# EasyEDA Pro project EDev.epro

# Schematic Schematic1
Board Name: Board1; Create Date: 2025-07-24; Page Name: P1; Project Name: ODO2; Schematic Name: Schematic1; Update Date: 2025-07-24; Company: EasyEDA.com; Page Size: A4; Version: V1.0
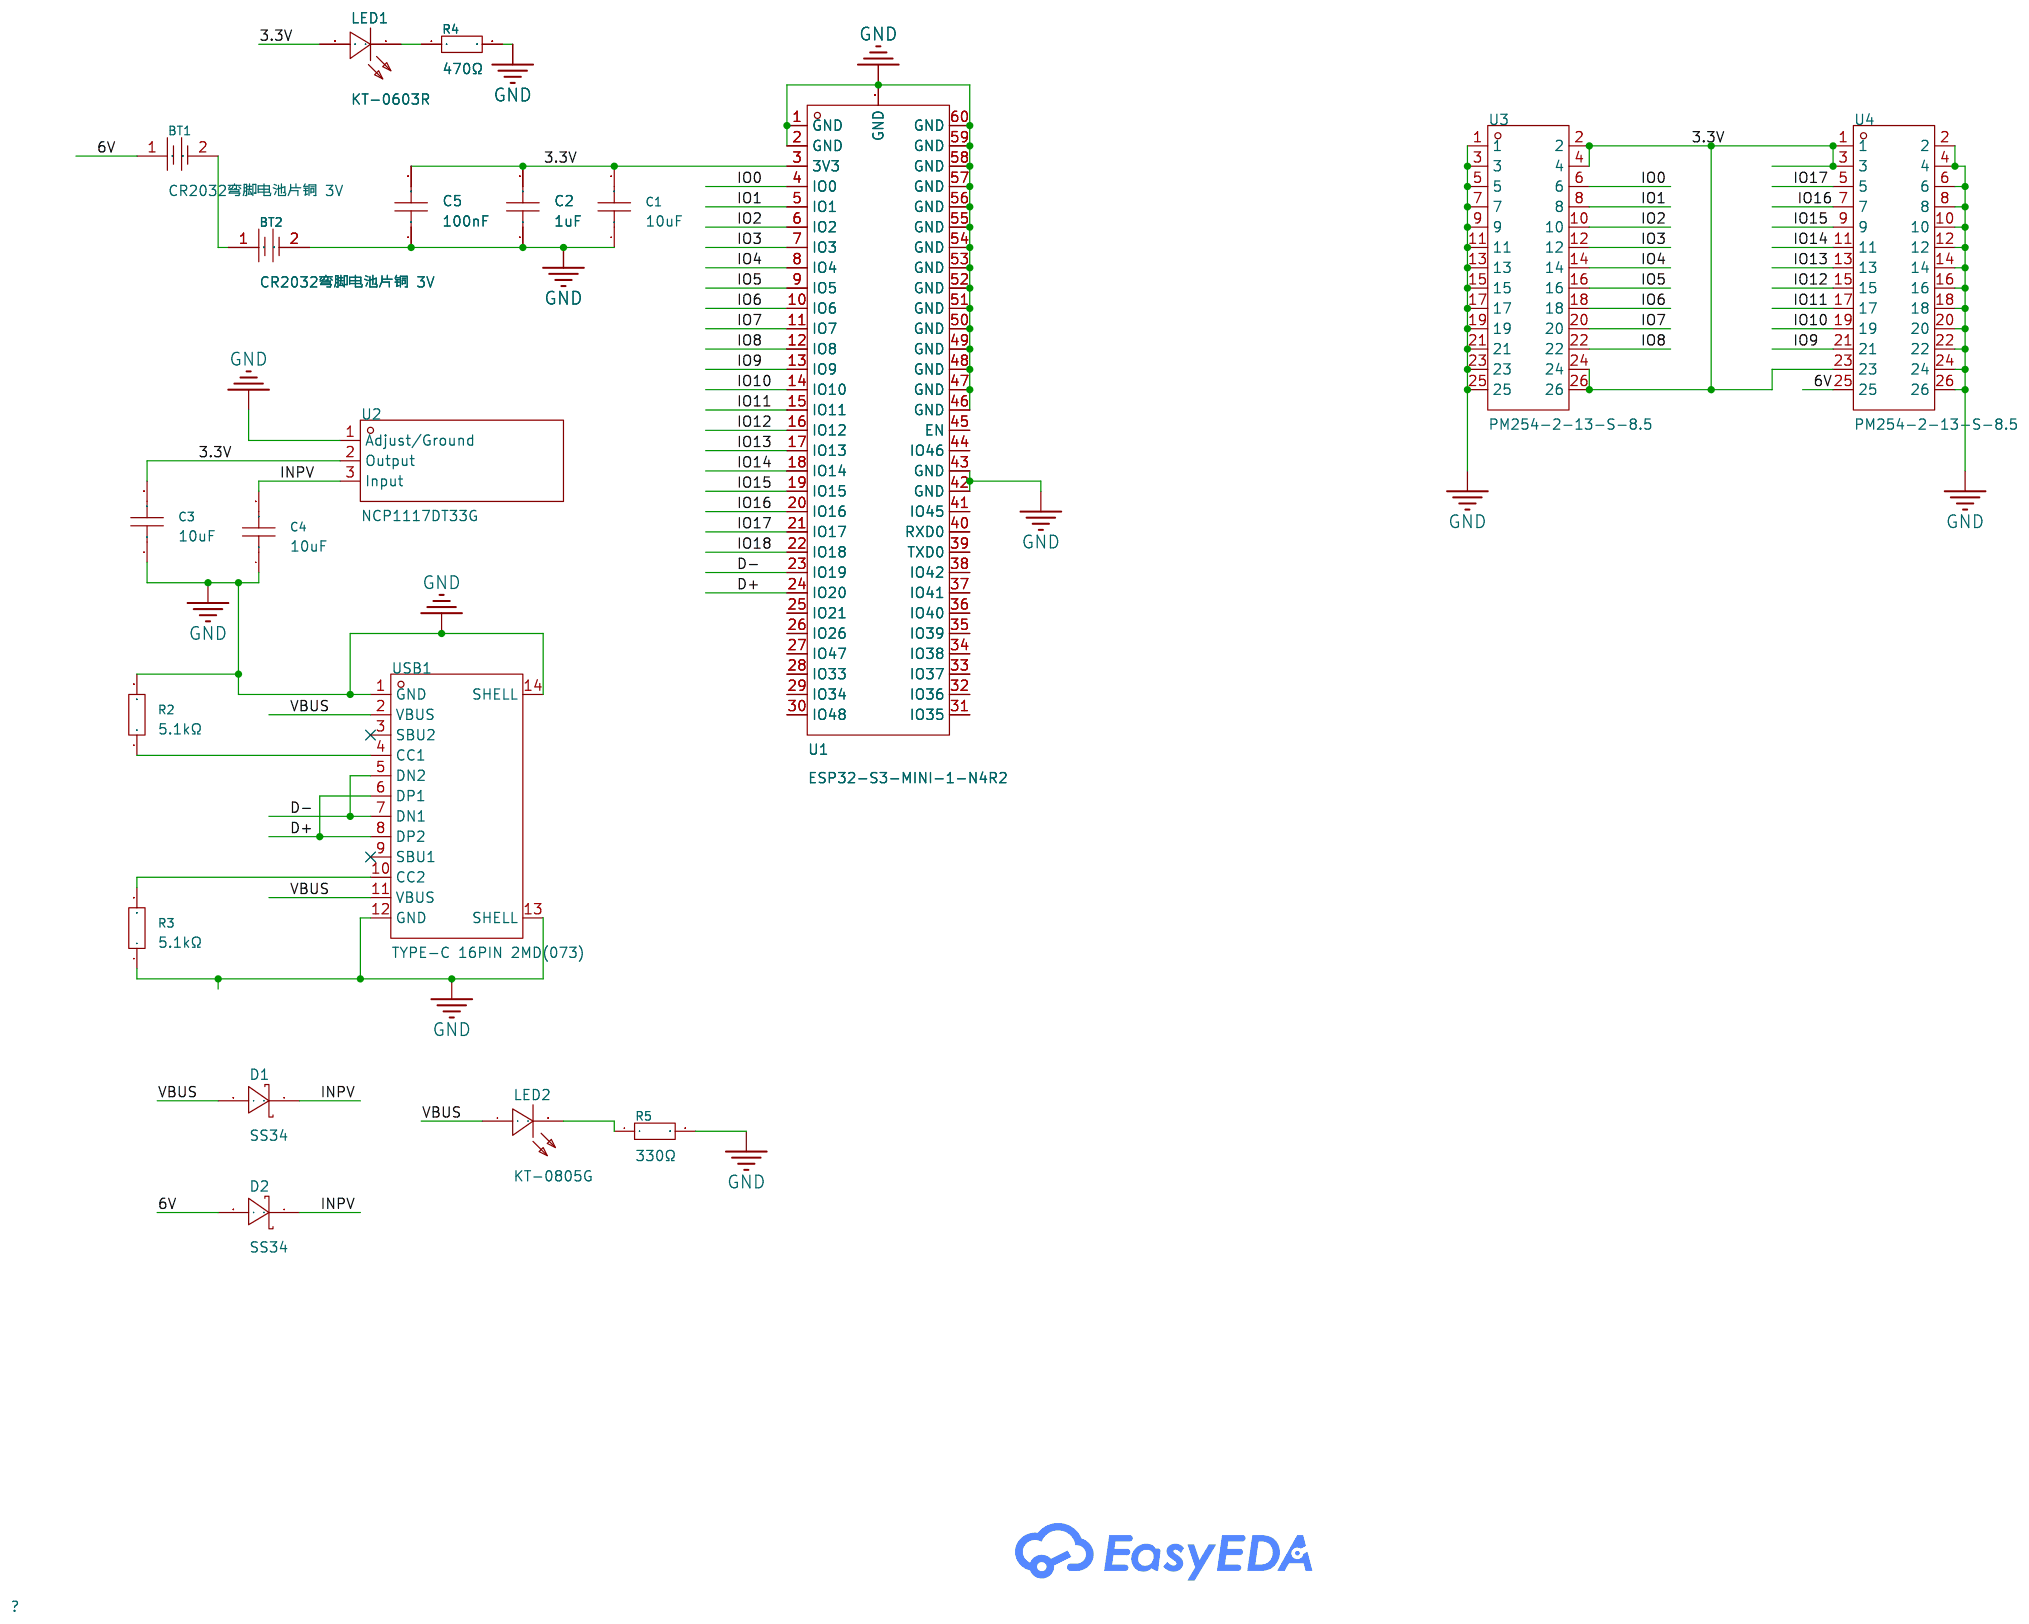
[diagram p0: schematic sheet]

## Parts
BT1  CR2032弯脚电池片铜 3V  [BAT-SMD_CR2032-3V]
BT2  CR2032弯脚电池片铜 3V  [BAT-SMD_CR2032-3V]
C1  10uF  [C0603]
C2  1uF  [C0603]
C3  10uF  [C0603]
C4  10uF  [C0603]
C5  100nF  [C0402]
D1  SS34  [SMA_L4.3-W2.6-LS5.2-RD]
D2  SS34  [SMA_L4.3-W2.6-LS5.2-RD]
LED1  KT-0603R  [LED0603-RD]
LED2  KT-0805G  [LED0805-R-RD]
R2  5.1kΩ  [R0402]
R3  5.1kΩ  [R0402]
R4  470Ω  [R0805]
R5  330Ω  [R0805]
U1  ESP32-S3-MINI-1-N4R2  [BULETM-SMD_ESP32-S3-MINI-1-N8]
U2  NCP1117DT33G  [TO-252_L6.5-W6.1-P4.58-LS9.9-BR]
U3  PM254-2-13-S-8.5  [HDR-SMD_26P-P2.54-V-F-R2-C13-LS7.2]
U4  PM254-2-13-S-8.5  [HDR-SMD_26P-P2.54-V-F-R2-C13-LS7.2]
USB1  TYPE-C 16PIN 2MD(073)  [USB-C-SMD_TYPE-C-6PIN-2MD-073]

## Library data of the parts
BT1 BT2 = CR2032弯脚电池片铜 3V: Connector Type:Battery button Battery Type:CR2032 Operating Temperature Range:- Operating Temperature Range:-; Supplier Part: C70373; Manufacturer: Q&J; Supplier Footprint: SMD; JLCPCB Part Class: Extended Part; Datasheet: https://atta.szlcsc.com/upload/public/pdf/source/20160427/1461725216470.pdf; Supplier: LCSC; Connector Type: Battery button; Battery Type: CR2032
C1 C3 C4 = CL10A106MA8NRNC: Capacitance: Tolerance:±20% Tolerance:±20% Voltage Rated: Temperature Coefficient:; LCSC Part Name: 10uF ±20% 25V; Supplier Part: C96446; Manufacturer: SAMSUNG(三星); Supplier Footprint: 0603; JLCPCB Part Class: Basic Part; Datasheet: https://atta.szlcsc.com/upload/public/pdf/source/20160218/1457707763339.pdf; Supplier: LCSC; Tolerance: ±20%
C2 = CL10A105KB8NNNC: Capacitance: Tolerance:±10% Tolerance:±10% Voltage Rated: Temperature Coefficient:; LCSC Part Name: 1uF ±10% 50V; Supplier Part: C15849; Manufacturer: SAMSUNG(三星); Supplier Footprint: 0603; JLCPCB Part Class: Basic Part; Datasheet: https://atta.szlcsc.com/upload/public/pdf/source/20160218/1457707763339.pdf; Supplier: LCSC; Tolerance: ±10%
C5 = CL05B104KO5NNNC: Capacitance: Tolerance:±10% Tolerance:±10% Voltage Rated: Temperature Coefficient:; LCSC Part Name: 100nF ±10% 16V; Supplier Part: C1525; Manufacturer: SAMSUNG(三星); Supplier Footprint: 0402; JLCPCB Part Class: Basic Part; Datasheet: https://atta.szlcsc.com/upload/public/pdf/source/20160218/1457707763339.pdf; Supplier: LCSC; Tolerance: ±10%
D1 D2 = SS34_C8678: Diode Configuration:Independent Type Forward Voltage (Vf@If):550mV@3A Reverse Voltage (Vr):40V Rectified Current:3A Reverse Leakage Current (Ir):500uA@40V; LCSC Part Name: 电压:40V 电流:3A; Supplier Part: C8678; Manufacturer: MDD(辰达半导体); Supplier Footprint: SMA(DO-214AC); JLCPCB Part Class: Basic Part; Datasheet: https://atta.szlcsc.com/upload/public/pdf/source/20240710/2118BB86FDDB2E0B294389AC1F3F65C8.pdf; Supplier: LCSC; Diode Configuration: Independent Type; Forward Voltage (Vf@If): 550mV@3A; Reverse Voltage (Vr): 40V; Rectified Current: 3A; Reverse Leakage Current (Ir): 500uA@40V
LED1 = KT-0603R: Emitted Color:Red Power Dissipation:- Forward Current:- Dominant Wavelength:- Dominant Wavelength:- Peak Wavelength:- Diode Configuration:- Lens Color:- Color Temperature:- Color Temperature:- Viewing Angle:- Mounting Sytle:- Operating Temperature:-40℃~+8; LCSC Part Name: 0603 红灯 高亮; Supplier Part: C2286; Manufacturer: KENTO; Supplier Footprint: 0603; JLCPCB Part Class: Basic Part; Datasheet: https://atta.szlcsc.com/upload/public/pdf/source/20160616/1466072038404.pdf; Supplier: LCSC; Emitted Color: Red; Operating Temperature: -40℃~+85℃
LED2 = KT-0805G: Lamp Holder Type:- Emitted Color:Emerald Forward Voltage (VF):- Forward Voltage (VF):- Power Dissipation:- Forward Current:- Dominant Wavelength:- Dominant Wavelength:- Peak Wavelength:- Diode Configuration:- Lens Color:- Color Temperature:- Color Tempera; LCSC Part Name: 0805 翠绿 高亮; Supplier Part: C2297; Manufacturer: KENTO; Supplier Footprint: 0805; JLCPCB Part Class: Basic Part; Datasheet: https://atta.szlcsc.com/upload/public/pdf/source/20170209/1486607340485.pdf; Supplier: LCSC; Emitted Color: Emerald
R2 R3 = 0402WGF5101TCE: Type:Thick Film Resistors Resistance:5.1kΩ Tolerance:±1% Tolerance:±1% Power(Watts): Overload Voltage (Max): Temperature Coefficient:±100ppm/℃ Temperature Coefficient:±100ppm/℃ Operating Temperature Range:-55℃~+155℃ Operating Temperature Range:-55℃~+155℃; LCSC Part Name: 5.1kΩ ±1% 62.5mW 厚膜电阻; Supplier Part: C25905; Manufacturer: UNI-ROYAL(厚声); Supplier Footprint: 0402; JLCPCB Part Class: Basic Part; Datasheet: https://atta.szlcsc.com/upload/public/pdf/source/20200306/C422600_1E6D84923E4A46A82E41ADD87F860B5C.pdf; Supplier: LCSC; Type: Thick Film Resistors; Tolerance: ±1%; Temperature Coefficient: ±100ppm/℃; Operating Temperature Range: -55℃~+155℃
R4 = 0805W8F4700T5E: Type:Thick Film Resistors Resistance: Tolerance:±1% Tolerance:±1% Power(Watts): Overload Voltage (Max): Temperature Coefficient:±100ppm/℃ Temperature Coefficient:±100ppm/℃ Operating Temperature Range:-55℃~+155℃ Operating Temperature Range:-55℃~+155℃; LCSC Part Name: 470Ω ±1% 125mW 厚膜电阻; Supplier Part: C17710; Manufacturer: UNI-ROYAL(厚声); Supplier Footprint: 0805; JLCPCB Part Class: Basic Part; Datasheet: https://atta.szlcsc.com/upload/public/pdf/source/20200306/C422600_1E6D84923E4A46A82E41ADD87F860B5C.pdf; Supplier: LCSC; Type: Thick Film Resistors; Tolerance: ±1%; Temperature Coefficient: ±100ppm/℃; Operating Temperature Range: -55℃~+155℃
R5 = 0805W8F3300T5E: Type:Thick Film Resistors Resistance: Tolerance:±1% Tolerance:±1% Power(Watts): Overload Voltage (Max): Temperature Coefficient:±100ppm/℃ Temperature Coefficient:±100ppm/℃ Operating Temperature Range:-55℃~+155℃ Operating Temperature Range:-55℃~+155℃; LCSC Part Name: 330Ω ±1% 125mW 厚膜电阻; Supplier Part: C17630; Manufacturer: UNI-ROYAL(厚声); Supplier Footprint: 0805; JLCPCB Part Class: Basic Part; Datasheet: https://atta.szlcsc.com/upload/public/pdf/source/20200306/C422600_1E6D84923E4A46A82E41ADD87F860B5C.pdf; Supplier: LCSC; Type: Thick Film Resistors; Tolerance: ±1%; Temperature Coefficient: ±100ppm/℃; Operating Temperature Range: -55℃~+155℃
U1 = ESP32-S3-MINI-1-N4R2: Antenna Type:On-Board PCB Antenna; Supplier Part: C3013941; Manufacturer: ESPRESSIF(乐鑫); Supplier Footprint: SMD; JLCPCB Part Class: Extended Part; Supplier: LCSC; Antenna Type: On-Board PCB Antenna
U2 = NCP1117DT33G: Output Type:Fixed Maximum Input Voltage:20V Output Voltage:3.3V Output Voltage:3.3V Output Current:1A Power Supply Rejection Ratio (PSRR):64dB@(120Hz) Dropout Voltage:1.2V@(800mA) standby current:10mA Feature:ESD Protection；Thermal Protection(TSD)；Overcur; LCSC Part Name: NCP1117DT33G 停产; Supplier Part: C154606; Manufacturer: onsemi(安森美); Supplier Footprint: TO-252; JLCPCB Part Class: Extended Part; Datasheet: https://atta.szlcsc.com/upload/public/pdf/source/20220427/B2E229834B7C3B3BD212A269AE861712.pdf; Supplier: LCSC; Output Type: Fixed; Maximum Input Voltage: 20V; Output Voltage: 3.3V; Output Current: 1A; Power Supply Rejection Ratio (PSRR): 64dB@(120Hz); Dropout Voltage: 1.2V@(800mA); standby current: 10mA; Feature: ESD Protection；Thermal Protection(TSD)；Overcurrent Protection(OCP); Operating Temperature: 0℃~+125℃; Output Polarity: Positive electrode; Number of Outputs: 1
U3 U4 = PM254-2-13-S-8.5: Holes Structure:2x13P Pitch:2.54mm Row Spacing:2.54mm Circular Hole / Square Hole:方孔 Mounting Type:Brick nogging Number of Rows:双排 Number of Holes:26P Current Rating (Max):3A Holes Direction:Top Insulation Height:8.5mm Contact Material:Copper Alloy Operat; LCSC Part Name: 2x13P 间距:2.54mm 立贴; Supplier Part: C3975158; Manufacturer: HCTL(华灿天禄); Supplier Footprint: SMD,P=2.54mm; JLCPCB Part Class: Extended Part; Datasheet: https://atta.szlcsc.com/upload/public/pdf/source/20230609/7C6F8D8E301C6BBC8F19D55951C36597.pdf; Supplier: LCSC; Holes Structure: 2x13P; Pitch: 2.54mm; Row Spacing: 2.54mm; Circular Hole / Square Hole: 方孔; Mounting Type: Brick nogging; Number of Rows: 双排; Number of Holes: 26P; Current Rating (Max): 3A; Holes Direction: Top; Insulation Height: 8.5mm; Contact Material: Copper Alloy; Operating Temperature Range: -40℃~+105℃; Soldering Temperature(Max): 260℃@5S
USB1 = TYPE-C 16PIN 2MD(073): Connector Type:Type-C Protocol Standard:USB 3.1 Gender:Female Mounting Type:Surface Mount, Right Angle Number of Contacts:16P Number of Ports:1 Current Rating-Power:3A Voltage Rating:5V Connect-Disconnect Life:5,000 Cycles Supplementary Features:- Center; LCSC Part Name: Type-C 母 卧贴; Supplier Part: C2765186; Manufacturer: SHOU HAN(首韩); Supplier Footprint: SMD; JLCPCB Part Class: Extended Part; Datasheet: https://atta.szlcsc.com/upload/public/pdf/source/20250506/FFB74EDFDFA0AC372CE4A8E4F739CCEF.pdf; Supplier: LCSC; Connector Type: Type-C; Protocol Standard: USB 3.1; Gender: Female; Mounting Type: Surface Mount, Right Angle; Number of Contacts: 16P; Number of Ports: 1; Current Rating-Power: 3A; Voltage Rating: 5V; Connect-Disconnect Life: 5,000 Cycles; Detection color: Black; Operating Temperature: -25℃~+85℃

## Nets
3.3V: C1.2 C2.2 C3.2 C5.2 LED1.2(A) U1.3(3V3) U2.2(Output) U3.2 U3.4 U3.24 U3.26 U4.1 U4.3 U4.23
6V: BT1.1 D2.2(A) U4.25
GND: BT2.2 C1.1 C2.1 C3.1 C4.1 C5.1 R2.2 R3.1 R4.2 R5.2 U1.1(GND) U1.2(GND) U1.42(GND) U1.43(GND) U1.46(GND) U1.47(GND) U1.48(GND) U1.49(GND) U1.50(GND) U1.51(GND) U1.52(GND) U1.53(GND) U1.54(GND) U1.55(GND) U1.56(GND) U1.57(GND) U1.58(GND) U1.59(GND) U1.60(GND) U1.GND U2.1(Adjust/Ground) U3.1 U3.3 U3.5 U3.7 U3.9 U3.11 U3.13 U3.15 U3.17 U3.19 U3.21 U3.23 U3.25 U4.2 U4.4 U4.6 U4.8 U4.10 U4.12 U4.14 U4.16 U4.18 U4.20 U4.22 U4.24 U4.26 USB1.1(GND) USB1.12(GND) USB1.13(SHELL) USB1.14(SHELL)
VBUS: D1.2(A) LED2.1(A) USB1.2(VBUS) USB1.11(VBUS)
D+: U1.24(IO20) USB1.6(DP1) USB1.8(DP2)
D-: U1.23(IO19) USB1.5(DN2) USB1.7(DN1)
INPV: C4.2 D1.1(K) D2.1(K) U2.3(Input)
IO0: U1.4(IO0) U3.6
IO1: U1.5(IO1) U3.8
IO2: U1.6(IO2) U3.10
IO3: U1.7(IO3) U3.12
IO4: U1.8(IO4) U3.14
IO5: U1.9(IO5) U3.16
IO6: U1.10(IO6) U3.18
IO7: U1.11(IO7) U3.20
IO8: U1.12(IO8) U3.22
IO9: U1.13(IO9) U4.21
IO10: U1.14(IO10) U4.19
IO11: U1.15(IO11) U4.17
IO12: U1.16(IO12) U4.15
IO13: U1.17(IO13) U4.13
IO14: U1.18(IO14) U4.11
IO15: U1.19(IO15) U4.9
IO16: U1.20(IO16) U4.7
IO17: U1.21(IO17) U4.5
IO18: U1.22(IO18)
$1N1027: BT1.2 BT2.1
$1N1544: R3.2 USB1.10(CC2)
$1N1551: R2.1 USB1.4(CC1)
$1N3968: LED1.1(K) R4.1
$1N4174: LED2.2(K) R5.1

Not connected (* = marked no-connect by the designer): U1 25(IO21) 26(IO26) 27(IO47) 28(IO33) 29(IO34) 30(IO48) 31(IO35) 32(IO36) 33(IO37) 34(IO38) 35(IO39) 36(IO40) 37(IO41) 38(IO42) 39(TXD0) 40(RXD0) 41(IO45) 44(IO46) 45(EN); USB1 3(SBU2)* 9(SBU1)*

# Board PCB1
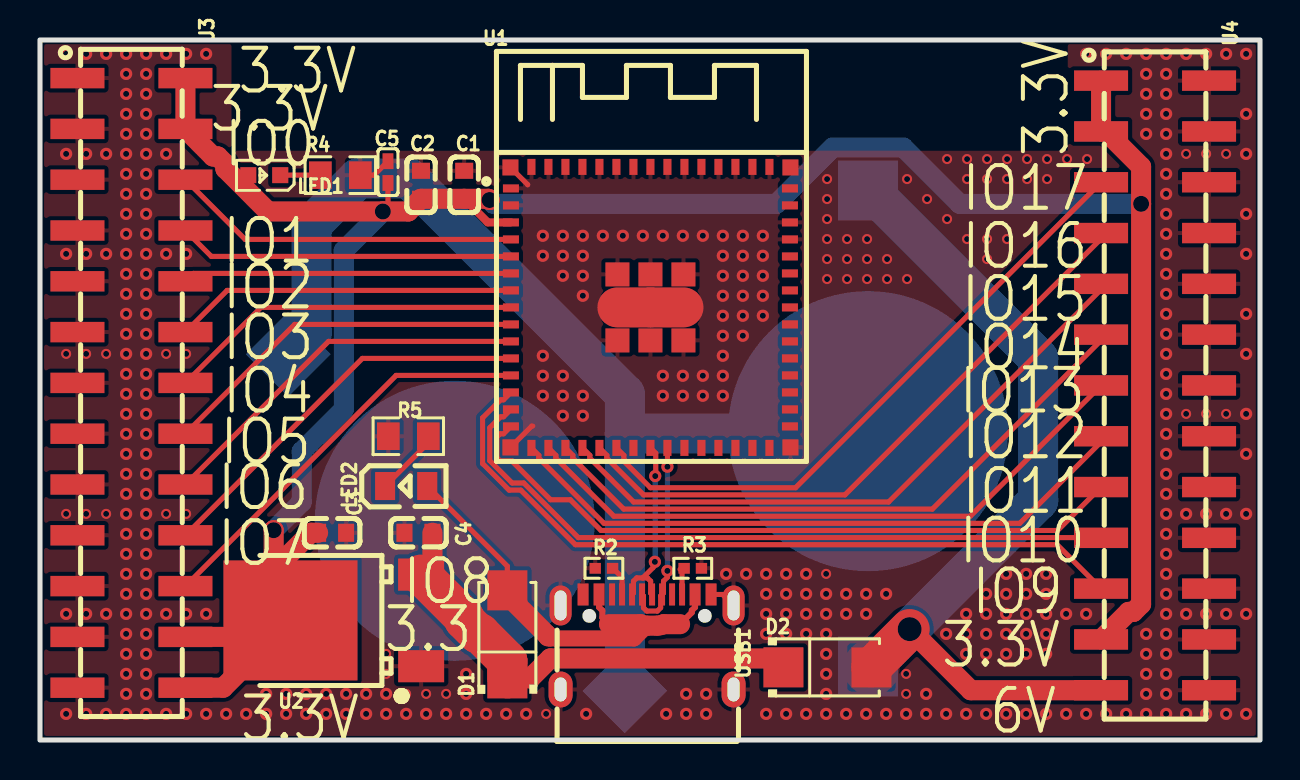
[diagram p1: board, top side]
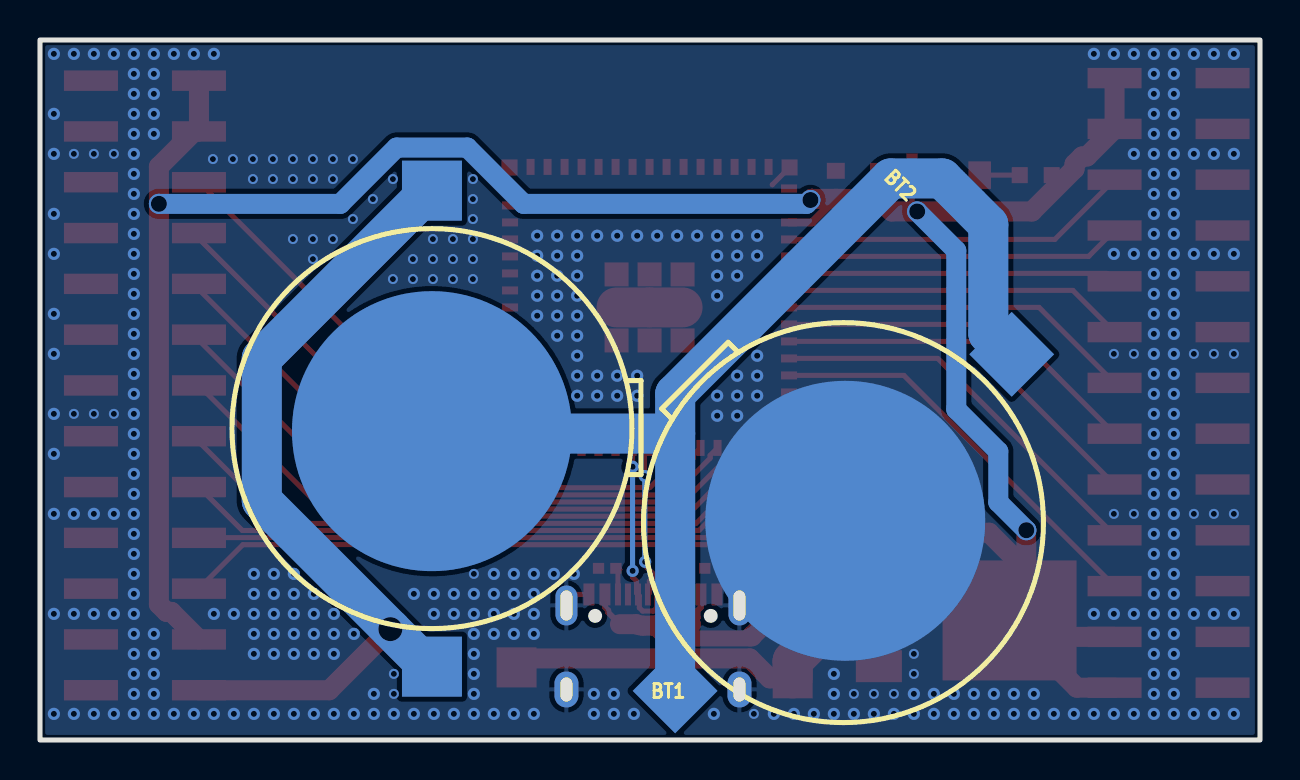
[diagram p2: board, bottom side, seen from below]

Outline 61 x 35 mm; copper layers: Top Layer, Bottom Layer. Coordinates in mm from the lower left corner of the outline.
Outline path: rectangle 0,35 61,0
Stack: Top Layer 0.035mm / Dielectric1 1.51mm FR4 er 4.5 / Bottom Layer 0.035mm

## Design rules (mm)
template: Custom Config
spacing copperThickness1oz (default): track to track 0.102, other pairs 0.152 to 0.3
spacing copperThickness2oz: track to track 0.203, other pairs 0.152 to 0.3
track width copperThickness1oz (default): min 0.127, default 0.254, max 2.54
track width copperThickness2oz: min 0.203, default 0.254, max 2.54
differential pair differentialPair (default): width min 0.127, default 0.254, max 2.54; gap min 0.152, default 0.152
via viaSize (default): diameter min 0.5, default 0.61, max 10; hole min 0.3, default 0.305, max 6.3
pour e593 uses copperRegion1

## Placement (name value [footprint] x y rotation side)
BT1  CR2032弯脚电池片铜 3V  [BAT-SMD_CR2032-3V]  41.4 15.57 0 bottom
BT2  CR2032弯脚电池片铜 3V  [BAT-SMD_CR2032-3V]  20.83 10.87 225 bottom
C1  10uF  [C0603]  21.21 27.76 270 top
C2  1uF  [C0603]  19.05 27.76 270 top
C3  10uF  [C0603]  14.6 10.36 180 top
C4  10uF  [C0603]  18.92 10.36 0 top
C5  100nF  [C0402]  17.4 28.4 270 top
D1  SS34  [SMA_L4.3-W2.6-LS5.2-RD]  23.37 5.28 90 top
D2  SS34  [SMA_L4.3-W2.6-LS5.2-RD]  39.37 3.63 0 top
LED1  KT-0603R  [LED0603-RD]  11.21 28.24 180 top
LED2  KT-0805G  [LED0805-R-RD]  18.31 12.7 0 top
R2  5.1kΩ  [R0402]  28.19 8.58 180 top
R3  5.1kΩ  [R0402]  32.64 8.58 180 top
R4  470Ω  [R0805]  15.02 28.24 0 top
R5  330Ω  [R0805]  18.41 15.19 180 top
U1  ESP32-S3-MINI-1-N4R2  [BULETM-SMD_ESP32-S3-MINI-1-N8]  30.52 21.63 0 top
U2  NCP1117DT33G  [TO-252_L6.5-W6.1-P4.58-LS9.9-BR]  15.79 5.98 0 top
U3  PM254-2-13-S-8.5  [HDR-SMD_26P-P2.54-V-F-R2-C13-LS7.2]  4.57 17.86 270 top
U4  PM254-2-13-S-8.5  [HDR-SMD_26P-P2.54-V-F-R2-C13-LS7.2]  55.75 17.73 270 top
USB1  TYPE-C 16PIN 2MD(073)  [USB-C-SMD_TYPE-C-6PIN-2MD-073]  30.35 4.9 0 top

## Footprints (pads in the part's own frame, mm; a bottom-side part is the same pattern mirrored in y, then rotated)
BAT-SMD_CR2032-3V
  rect 3x3 smd: 1(0,-11.9) 1(0,11.9)
  round 14 smd: 2(0,0.127)
BULETM-SMD_ESP32-S3-MINI-1-N8
  rect 0.8x0.4 smd: 1(-6.975,5.95) 2(-6.975,5.1) 3(-6.975,4.25) 4(-6.975,3.4) 5(-6.975,2.55) 6(-6.975,1.7) 7(-6.975,0.85) 8(-6.975,0) 9(-6.975,-0.85) 10(-6.975,-1.7) 11(-6.975,-2.55) 12(-6.975,-3.4) 13(-6.975,-4.25) 14(-6.975,-5.1) 15(-6.975,-5.95) 31(6.975,-5.95) 32(6.975,-5.1) 33(6.975,-4.25) 34(6.975,-3.4) 35(6.975,-2.55) 36(6.975,-1.7) 37(6.975,-0.85) 38(6.975,0) 39(6.975,0.85) 40(6.975,1.7) 41(6.975,2.55) 42(6.975,3.4) 43(6.975,4.25) 44(6.975,5.1) 45(6.975,5.95)
  rect 0.4x0.8 smd: 16(-5.95,-7.025) 17(-5.1,-7.025) 18(-4.25,-7.025) 19(-3.4,-7.025) 20(-2.55,-7.025) 21(-1.7,-7.025) 22(-0.85,-7.025) 23(0,-7.025) 24(0.85,-7.025) 25(1.7,-7.025) 26(2.55,-7.025) 27(3.4,-7.025) 28(4.25,-7.025) 29(5.1,-7.025) 30(5.95,-7.025) 46(5.95,7.025) 47(5.1,7.025) 48(4.25,7.025) 49(3.4,7.025) 50(2.55,7.025) 51(1.7,7.025) 52(0.85,7.025) 53(0,7.025) 54(-0.85,7.025) 55(-1.7,7.025) 56(-2.55,7.025) 57(-3.4,7.025) 58(-4.25,7.025) 59(-5.1,7.025) 60(-5.95,7.025)
  rect 0.8x0.8 smd: GND(-7,7) GND(-7,-7) GND(7,7) GND(7,-7)
  rect 1.2x1.2 smd: GND(-1.65,1.65) GND(-1.65,0) GND(-1.65,-1.65) GND(0,1.65) GND(0,0) GND(0,-1.65) GND(1.65,1.65) GND(1.65,0) GND(1.65,-1.65)
C0402
  rect 0.79x0.54 smd: 1(-0.545,0) 2(0.545,0)
C0603
  rect 0.8x0.9 smd: 1(-0.7,0) 2(0.7,0)
HDR-SMD_26P-P2.54-V-F-R2-C13-LS7.2
  rect 1.02x2.7 smd: 1(-15.24,-2.7) 2(-15.24,2.7) 3(-12.7,-2.7) 4(-12.7,2.7) 5(-10.16,-2.7) 6(-10.16,2.7) 7(-7.62,-2.7) 8(-7.62,2.7) 9(-5.08,-2.7) 10(-5.08,2.7) 11(-2.54,-2.7) 12(-2.54,2.7) 13(0,-2.7) 14(0,2.7) 15(2.54,-2.7) 16(2.54,2.7) 17(5.08,-2.7) 18(5.08,2.7) 19(7.62,-2.7) 20(7.62,2.7) 21(10.16,-2.7) 22(10.16,2.7) 23(12.7,-2.7) 24(12.7,2.7) 25(15.24,-2.7) 26(15.24,2.7)
LED0603-RD
  rect 0.8x0.8 smd: 1(-0.799,0) 2(0.799,0)
LED0805-R-RD
  rect 1x1.399 smd: 1(1.05,0) 2(-1.05,0)
R0402
  rect 0.566x0.54 smd: 1(-0.433,0) 2(0.433,0)
R0805
  rect 1.133x1.377 smd: 1(-1,0) 2(1,0)
SMA_L4.3-W2.6-LS5.2-RD
  rect 2x2 smd: 1(-2.2,0) 2(2.2,0)
TO-252_L6.5-W6.1-P4.58-LS9.9-BR
  rect 2.3x1.6 smd: 1(3.268,-2.29) 3(3.267,2.29)
  rect 6.7x6 smd: 2(-3.268,0)
USB-C-SMD_TYPE-C-6PIN-2MD-073
  rect 0.55x1.1 smd: 1(-3.2,2.375) 2(-2.4,2.375) 11(2.4,2.375) 12(3.2,2.375)
  rect 0.3x1.1 smd: 3(-1.75,2.375) 4(-1.25,2.375) 5(-0.75,2.375) 6(-0.25,2.375) 7(0.25,2.375) 8(0.75,2.375) 9(1.25,2.375) 10(1.75,2.375)
  oval 1.1x2 hole 0.6x1.5: 13(-4.325,1.825) 14(4.325,1.825)
  oval 1.2x1.8 hole 0.6x1.2: 13(-4.325,-2.375) 14(4.325,-2.375)

## Nets
As in the schematic.

Pads without a net: U1 25 26 27 28 29 30 31 32 33 34 35 36 37 38 39 40 41 44 45; USB1 3 9

## Via types
v1: diameter 0.61, hole 0.305, Top Layer to Bottom Layer, 320 vias
v2: diameter 0.5, hole 0.3, Top Layer to Bottom Layer, 60 vias
v3: diameter 1, hole 0.8, Top Layer to Bottom Layer, 4 vias
v4: diameter 1.5, hole 1.2, Top Layer to Bottom Layer, 1 via

## Routing (per net, layer and track width the routed paths; a pad name or vN(x,y) marks a point on that pad's centre or on a via; arc(x,y) is an arc through that point)
3.3V: length 123.4
  Top Layer w0.254: v3(17.14,26.43) 17.4,26.68 C5.2
  Top Layer w0.4: U1.3 22.39,25.88 C1.2
  Top Layer w1: U4.1 53.05,30.43 53.29,30.43 55.06,28.67 v3(55.06,26.81) 55.06,6.79 54.67,6.41 54.43,6.41 U4.23 ; v3(22.48,27) 22.42,27.06 C1.2 C2.2 18.41,26.43 v3(17.14,26.43) 11.4,26.43 9.27,28.55 9.27,28.8 8.89,29.18 8.65,29.18 U3.4 U3.2 ; v3(11.68,10.49) 11.68,8.5 13.54,10.36 C3.2 ; 11.7,5.16 9.16,2.61 U3.26 ; 11.7,5.16 U3.24 ; 11.7,5.16 U2.2
  Bottom Layer w1: v3(55.06,26.81) 45.99,26.81 43.17,29.62 39.63,29.62 36.82,26.81 22.67,26.81 v3(22.48,27) ; v3(11.68,10.49) 13.09,11.89 13.09,14.43 15.19,16.53 15.19,24.47 v3(17.14,26.43)
6V: length 44.6
  Top Layer w1: 53.05,2.49 46.54,2.49 v4(43.48,5.54)
  Top Layer w2: D2.2 v4(43.48,5.54)
  Bottom Layer w2: BT1.1 41.61,3.67 v4(43.48,5.54) 49.91,11.97 49.91,19.09 41.53,27.47 BT1.1
GND: length 9.1
  Top Layer w0.254: 24.64,15.7 24.59,15.7 23.52,14.63 ; C5.1 16.7,28.24 R4.2 ; 34.68,6.73 34.13,7.28 USB1.12 ; 23.52,28.63 24.38,27.77 24.38,27.76
  Top Layer w2: 28.87,21.63 32.17,21.63
  vias: v1(1.31,34.31) v1(1.31,29.31) v1(1.31,24.31) v1(1.31,6.31) v1(1.31,1.31) v1(2.31,34.31) v1(2.31,29.31) v1(2.31,24.31) v1(2.31,6.31) v1(2.31,1.31) v1(3.31,34.31) v1(3.31,29.31) v1(3.31,24.31) v1(3.31,6.31) v1(3.31,1.31) v1(4.31,34.31) v1(4.31,33.31) v1(4.31,32.31) v1(4.31,31.31) v1(4.31,30.31) v1(4.31,29.31) v1(4.31,28.31) v1(4.31,27.31) v1(4.31,26.31) v1(4.31,25.31) v1(4.31,24.31) v1(4.31,23.31) v1(4.31,22.31) v1(4.31,21.31) v1(4.31,20.31) v1(4.31,19.31) v1(4.31,18.31) v1(4.31,17.31) v1(4.31,16.31) v1(4.31,15.31) v1(4.31,14.31) v1(4.31,13.31) v1(4.31,12.31) v1(4.31,11.31) v1(4.31,10.31) v1(4.31,9.31) v1(4.31,8.31) v1(4.31,7.31) v1(4.31,6.31) v1(4.31,5.31) v1(4.31,4.31) v1(4.31,3.31) v1(4.31,2.31) v1(4.31,1.31) v1(5.31,34.31) v1(5.31,33.31) v1(5.31,32.31) v1(5.31,31.31) v1(5.31,30.31) v1(5.31,29.31) v1(5.31,28.31) v1(5.31,27.31) v1(5.31,26.31) v1(5.31,25.31) v1(5.31,24.31) v1(5.31,23.31) v1(5.31,22.31) v1(5.31,21.31) v1(5.31,20.31) v1(5.31,19.31) v1(5.31,18.31) v1(5.31,17.31) v1(5.31,16.31) v1(5.31,15.31) v1(5.31,14.31) v1(5.31,13.31) v1(5.31,12.31) v1(5.31,11.31) v1(5.31,10.31) v1(5.31,9.31) v1(5.31,8.31) v1(5.31,7.31) v1(5.31,6.31) v1(5.31,5.31) v1(5.31,4.31) v1(5.31,3.31) v1(5.31,2.31) v1(5.31,1.31) v1(6.31,34.31) v1(6.31,29.31) v1(6.31,24.31) v1(6.31,6.31) v1(6.31,1.31) v1(7.31,34.31) v1(7.31,24.31) v1(7.31,6.31) v1(7.31,1.31) v1(8.31,34.31) v1(8.31,6.31) v1(8.31,1.31) v1(9.31,1.31) v1(10.31,1.31) v1(11.31,2.31) v1(11.31,1.31) v1(12.31,2.31) v1(12.31,1.31) v1(13.31,2.31) v1(13.31,1.31) v1(14.31,2.31) v1(14.31,1.31) v1(15.31,2.31) v1(15.31,1.31) v1(16.31,2.31) v1(16.31,1.31) v1(17.31,2.31) v1(17.31,1.31) v1(18.31,1.31) v1(19.31,1.31) v1(20.31,1.31) v1(21.31,3.31) v1(21.31,2.31) v1(21.31,1.31) v1(22.31,1.31) v1(23.31,1.31) v1(24.31,1.31) v1(25.14,25.21) v1(25.14,24.21) v1(25.14,19.21) v1(25.14,18.21) v1(25.14,17.21) v1(26.14,25.21) v1(26.14,24.21) v1(26.14,23.21) v1(26.14,18.21) v1(26.14,17.21) v1(26.14,16.21) v1(27.14,25.21) v1(27.14,24.21) v1(27.14,23.21) v1(27.14,22.21) v1(27.14,17.21) v1(27.14,16.21) v1(27.31,1.31) v1(28.14,25.21) v1(29.14,25.21) v1(30.14,25.21) v1(31.14,25.21) v1(31.14,18.21) v1(31.14,17.21) v1(31.31,1.31) v1(32.14,25.21) v1(32.14,18.21) v1(32.14,17.21) v1(32.31,2.31) v1(32.31,1.31) v1(33.14,25.21) v1(33.14,18.21) v1(33.14,17.21) v1(33.31,2.31) v1(33.31,1.31) v1(34.14,25.21) v1(34.14,24.21) v1(34.14,23.21) v1(34.14,22.21) v1(34.14,21.21) v1(34.14,20.21) v1(34.14,19.21) v1(34.14,18.21) v1(34.14,17.21) v1(34.31,8.31) v1(35.14,25.21) v1(35.14,24.21) v1(35.14,23.21) v1(35.14,22.21) v1(35.14,21.21) v1(35.14,20.21) v1(35.31,8.31) v1(36.14,25.21) v1(36.14,24.21) v1(36.14,23.21) v1(36.14,22.21) v1(36.14,21.21) v1(36.31,8.31) v1(36.31,7.31) v1(36.31,6.31) v1(36.31,5.31) v1(36.31,1.31) v1(37.31,8.31) v1(37.31,7.31) v1(37.31,6.31) v1(37.31,5.31) v1(37.31,1.31) v1(38.31,8.31) v1(38.31,7.31) v1(38.31,6.31) v1(38.31,5.31) v1(38.31,1.31) v1(39.31,7.31) v1(39.31,6.31) v1(39.31,5.31) v1(39.31,4.31) v1(39.31,3.31) v1(39.31,2.31) v1(39.31,1.31) v1(40.31,7.31) v1(40.31,6.31) v1(40.31,1.31) v1(41.31,7.31) v1(41.31,6.31) v1(41.31,1.31) v1(42.31,7.31) v1(42.31,1.31) v1(43.31,1.31) v1(44.31,2.31) v1(44.31,1.31) v1(45.31,5.31) v1(45.31,1.31) v1(46.31,6.31) v1(46.31,5.31) v1(46.31,4.31) v1(46.31,1.31) v1(47.31,7.31) v1(47.31,6.31) v1(47.31,5.31) v1(47.31,4.31) v1(47.31,1.31) v1(48.31,8.31) v1(48.31,7.31) v1(48.31,6.31) v1(48.31,5.31) v1(48.31,4.31) v1(48.31,1.31) v1(49.31,8.31) v1(49.31,7.31) v1(49.31,6.31) v1(49.31,5.31) v1(49.31,4.31) v1(49.31,1.31) v1(50.31,8.31) v1(50.31,7.31) v1(50.31,6.31) v1(50.31,5.31) v1(50.31,4.31) v1(50.31,1.31) v1(51.31,6.31) v1(51.31,1.31) v1(52.31,34.31) v1(52.31,6.31) v1(52.31,1.31) v1(53.31,34.31) v1(53.31,1.31) v1(54.31,34.31) v1(54.31,1.31) v1(55.31,34.31) v1(55.31,33.31) v1(55.31,32.31) v1(55.31,31.31) v1(55.31,30.31) v1(55.31,5.31) v1(55.31,4.31) v1(55.31,3.31) v1(55.31,2.31) v1(55.31,1.31) v1(56.31,34.31) v1(56.31,33.31) v1(56.31,32.31) v1(56.31,31.31) v1(56.31,30.31) v1(56.31,29.31) v1(56.31,28.31) v1(56.31,27.31) v1(56.31,26.31) v1(56.31,25.31) v1(56.31,24.31) v1(56.31,23.31) v1(56.31,22.31) v1(56.31,21.31) v1(56.31,20.31) v1(56.31,19.31) v1(56.31,18.31) v1(56.31,17.31) v1(56.31,16.31) v1(56.31,15.31) v1(56.31,14.31) v1(56.31,13.31) v1(56.31,12.31) v1(56.31,11.31) v1(56.31,10.31) v1(56.31,9.31) v1(56.31,8.31) v1(56.31,7.31) v1(56.31,6.31) v1(56.31,5.31) v1(56.31,4.31) v1(56.31,3.31) v1(56.31,2.31) v1(56.31,1.31) v1(57.31,34.31) v1(57.31,11.31) v1(57.31,6.31) v1(57.31,1.31) v1(58.31,34.31) v1(58.31,11.31) v1(58.31,6.31) v1(58.31,1.31) v1(59.31,34.31) v1(59.31,11.31) v1(59.31,6.31) v1(59.31,1.31) v1(60.31,34.31) v1(60.31,31.31) v1(60.31,29.31) v1(60.31,26.31) v1(60.31,24.31) v1(60.31,21.31) v1(60.31,19.31) v1(60.31,16.31) v1(60.31,14.31) v1(60.31,11.31) v1(60.31,6.31) v1(60.31,1.31) v2(1.31,19.31) v2(1.31,11.31) v2(2.31,19.31) v2(2.31,11.31) v2(3.31,19.31) v2(3.31,11.31) v2(6.31,19.31) v2(6.31,11.31) v2(7.31,19.31) v2(7.31,11.31) v2(17.31,4.31) v2(17.31,3.31) v2(18.31,2.31) v2(19.31,2.31) v2(20.31,2.31) v2(25.31,1.31) v2(39.35,28.05) v2(39.35,27.05) v2(39.35,26.05) v2(39.35,25.05) v2(39.35,24.05) v2(39.35,23.05) v2(39.31,8.31) v2(40.35,25.05) v2(40.35,24.05) v2(40.35,23.05) v2(41.35,25.05) v2(41.35,24.05) v2(41.35,23.05) v2(42.35,24.05) v2(42.35,23.05) v2(43.35,28.05) v2(43.35,23.05) v2(43.31,3.31) v2(43.31,2.31) v2(44.35,27.05) v2(45.35,29.05) v2(45.35,26.05) v2(46.35,29.05) v2(46.35,28.05) v2(46.35,25.05) v2(47.35,29.05) v2(47.35,28.05) v2(47.35,25.05) v2(47.35,24.05) v2(48.35,29.05) v2(48.35,28.05) v2(48.35,25.05) v2(49.35,29.05) v2(49.35,28.05) v2(50.35,29.05) v2(50.35,28.05) v2(51.35,29.05) v2(52.35,29.05) v2(57.31,29.31) v2(57.31,16.31) v2(58.31,29.31) v2(58.31,16.31) v2(59.31,29.31) v2(59.31,16.31)
VBUS: length 22.3
  Top Layer w0.254: LED2.1 23.37,8.69 D1.2
  Top Layer w0.3: 28.45,5.79 28.11,6.12 28.11,6.48 27.95,6.64 USB1.2 ; USB1.11 32.75,6.64 32.59,6.48 32.59,6.38 32,5.79
  Top Layer w0.8: 25.4,5.18 25.5,5.08 29.7,5.08 30.34,5.72
  Top Layer w1: 32,5.79 31.18,5.79 arc(31.03,5.74) 30.87,5.72 30.34,5.72 arc(30.18,5.74) 30.02,5.79 28.45,5.79 ; 25.4,5.18 25.4,5.2 23.37,7.24 D1.2
D+: length 9.8
  Top Layer w0.254: U1.24 v1(31.37,13.66) ; v1(31.37,8.46) 31.37,8.14 31.17,7.94 31.17,7.35 USB1.8 31.03,7.2 31.03,6.61 30.87,6.45 30.34,6.45 30.17,6.61 30.17,7.2 USB1.6
  Bottom Layer w0.254: v1(31.37,13.66) 31.37,8.46 v1(31.37,8.46)
D-: length 9.4
  Top Layer w0.254: U1.23 30.79,14.34 30.79,13.42 30.76,13.4 v1(30.76,13.2) ; v1(30.74,8.91) 30.7,8.91 30.66,8.95 30.66,8.63 30.14,8.11 ; 30.14,8.11 29.84,8.11 29.67,7.94 29.67,7.35 USB1.5 ; 30.14,8.11 30.37,8.11 30.53,7.94 30.53,7.35 USB1.7
  Bottom Layer w0.254: v1(30.76,13.2) 30.76,8.93 v1(30.74,8.91)
INPV: length 23.8
  Top Layer w1: D2.1 36.72,4.08 25.51,4.08 24.51,3.08 23.37,3.08 ; 19.06,8.27 19.62,8.83 C4.2
  Top Layer w2: 23.37,3.08 23.37,3.96 22,5.33 21.89,5.33 21.22,6 21.22,6.11 19.06,8.27
IO0: length 17.5
  Top Layer w0.254: U3.6 10.26,25.03 23.55,25.03
IO1: length 16.8
  Top Layer w0.254: U3.8 8.57,24.18 U1.5
IO2: length 16.4
  Top Layer w0.254: 23.55,23.33 7.67,23.33 U3.10
IO3: length 17.1
  Top Layer w0.254: U1.7 9.36,22.48 U3.12
IO4: length 17.8
  Top Layer w0.254: U3.14 11.05,21.63 23.55,21.63
IO5: length 18.5
  Top Layer w0.254: U1.9 12.74,20.78 U3.16
IO6: length 19.2
  Top Layer w0.254: U3.18 14.43,19.93 23.55,19.93
IO7: length 19.9
  Top Layer w0.254: U1.11 16.12,19.08 U3.20
IO8: length 20.6
  Top Layer w0.254: 23.55,18.23 17.81,18.23 U3.22
IO9: length 37.7
  Top Layer w0.254: 53.05,7.57 50.86,9.77 26.77,9.77 24.04,12.49 23.46,12.49 22.13,13.82 22.13,16.11 23.03,17.01 23.18,17.01 U1.13
IO10: length 35.3
  Top Layer w0.254: U4.19 53.04,10.12 26.92,10.12 24.19,12.85 23.6,12.85 22.49,13.97 22.49,15.61 23.03,16.16 23.18,16.16 23.55,16.53
IO11: length 34.6
  Top Layer w0.254: 53.05,12.65 50.88,10.48 28.05,10.48 26.52,12.01 25.53,12.01 23.59,13.95 23.01,13.95 22.84,14.11 22.84,15.15 23.01,15.31 23.18,15.31 U1.15
IO12: length 32.1
  Top Layer w0.254: U4.15 53.05,14.9 48.98,10.83 28.2,10.83 24.94,14.09 24.94,14.23 24.57,14.6
IO13: length 31.8
  Top Layer w0.254: U1.17 25.79,14.23 25.79,14.09 28.69,11.19 46.51,11.19 U4.13
IO14: length 31.9
  Top Layer w0.254: 26.27,14.6 26.64,14.23 26.64,14.09 29.19,11.55 44.62,11.55 53.05,19.98 53.05,20.27
IO15: length 31.8
  Top Layer w0.254: U4.9 53.05,22.52 42.43,11.9 29.68,11.9 27.49,14.09 27.49,14.23 U1.19
IO16: length 31.7
  Top Layer w0.254: 53.05,25.35 53.05,25.06 40.25,12.26 30.18,12.26 28.34,14.09 28.34,14.23 27.97,14.6
IO17: length 31.6
  Top Layer w0.254: U4.5 37.78,12.61 30.52,12.61 29.19,13.94 29.19,14.23 U1.21
$1N1027: length 55.4
  Bottom Layer w2: BT1.2 41.28,15.32 29.24,15.32 ; 29.24,15.32 29.24,2.33 ; 29.24,15.32 29.24,17.3 18.46,28.08 15.89,28.08 13.58,25.77 13.58,20.33 12.41,19.16
$1N1544: length 1.3
  Top Layer w0.254: 32,8.53 32.1,8.43 USB1.10
$1N1551: length 1.4
  Top Layer w0.254: USB1.4 29.1,8.13 28.7,8.53
$1N3968: length 2
  Top Layer w0.254: LED1.1 R4.1
$1N4174: length 3.4
  Top Layer w0.254: R5.1 19.41,14.86 LED2.2

## Copper pours and planes (outline as drawn; the poured copper is in the pictures)
GND on Top Layer: -5.84,40.84 78.36,40.84 78.36,-14.15 -5.84,-14.15
GND on Bottom Layer: -2.92,39.45 61.21,39.45 61.21,-1.83 -2.92,-1.83

## Text on the board
Top Silkscreen Layer: 3.3V | IO6 | IO7 | IO5 | IO1 | IO2 | IO3 | IO4 | IO0 | 3.3 | IO8 | IO13 | IO10 | IO15 | IO16 | IO14 | IO12 | IO17 | IO11 | IO9 | 6V
